# EAGLE design shoes (EAGLE 6.0)
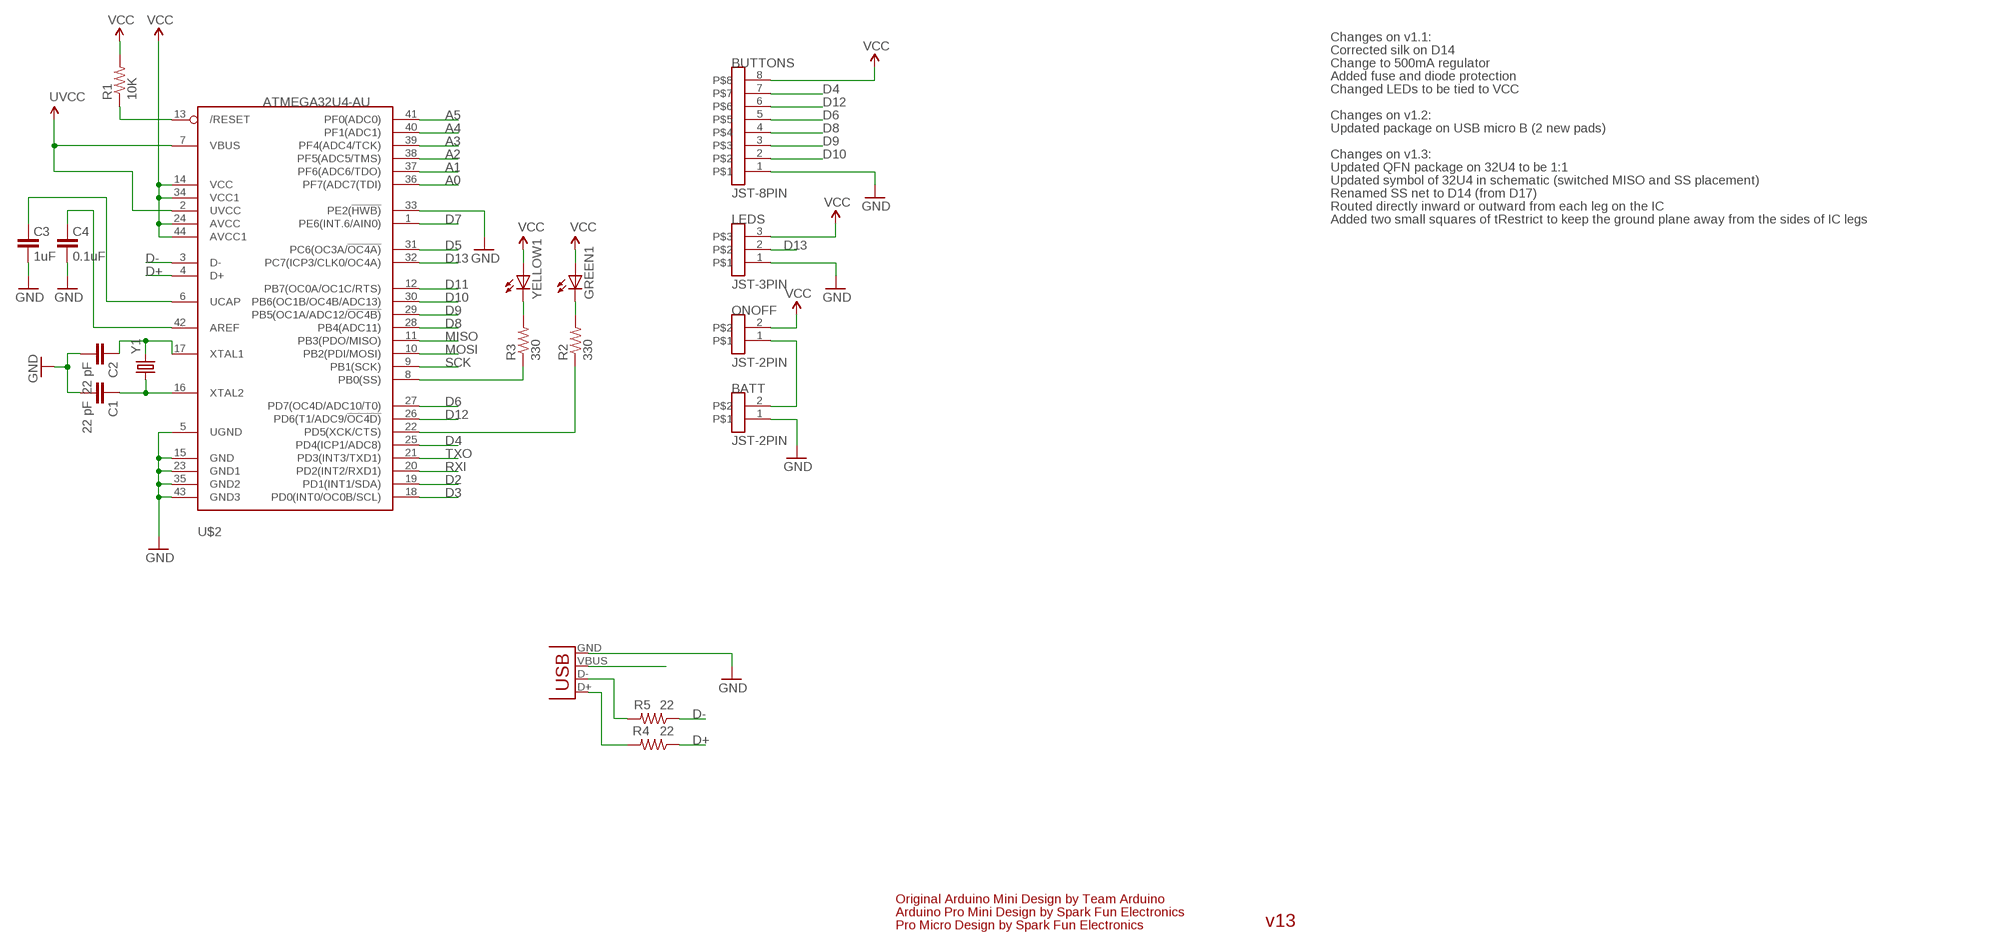
[diagram p0: schematic, sheet 1]

## Parts
BATT  JST-2PIN  [JST-PH-2]
BUTTONS  JST-8PIN  [JST-PH-8]
C1  22 pF  CAP0805  [0805]
C2  22 pF  CAP0805  [0805]
C3  1uF  CAP0805  [0805]
C4  0.1uF  CAP0805  [0805]
GREEN1  LED  [0805_P]
LEDS  JST-3PIN  [JST-PH-3]
ONOFF  JST-2PIN  [JST-PH-2]
R1  10K  RESISTOR0805-RES  [0805]
R2  330  RESISTOR0805-RES  [0805]
R3  330  RESISTOR0805-RES  [0805]
R4  22  RESISTOR0805-RES  [0805]
R5  22  RESISTOR0805-RES  [0805]
U$2  ATMEGA32U4-AU  [TQFP44]
X2  USB-MICROB  [USB-MICROB]
Y1  CRYSTALHC49US  [HC49US]
YELLOW1  LED  [0805_P]

## Nets
5V: BUTTONS.8 GREEN1.NEG(A) LEDS.3 ONOFF.2 R1.2 U$2.14(VCC) U$2.24(AVCC) U$2.34(VCC1) U$2.44(AVCC1) YELLOW1.NEG(A) ; supply symbol labelled VCC
A0: U$2.36(PF7(ADC7(TDI))
A1: U$2.37(PF6(ADC6/TDO))
A2: U$2.38(PF5(ADC5/TMS))
A3: U$2.39(PF4(ADC4/TCK))
A4: U$2.40(PF1(ADC1))
A5: U$2.41(PF0(ADC0))
D2: U$2.19(PD1(INT1/SDA))
D3: U$2.18(PD0(INT0/OC0B/SCL))
D4: BUTTONS.7 U$2.25(PD4(ICP1/ADC8))
D5: U$2.31(PC6(OC3A/!OC4A))
D6: BUTTONS.5 U$2.27(PD7(OC4D/ADC10/T0))
D7: U$2.1(PE6(INT.6/AIN0))
D8: BUTTONS.4 U$2.28(PB4(ADC11))
D9: BUTTONS.3 U$2.29(PB5(OC1A/ADC12/!OC4B))
D10: BUTTONS.2 U$2.30(PB6(OC1B/OC4B/ADC13))
D11: U$2.12(PB7(OC0A/OC1C/RTS))
D12: BUTTONS.6 U$2.26(PD6(T1/ADC9/!OC4D))
D13: LEDS.2 U$2.32(PC7(ICP3/CLK0/OC4A))
D14: R3.1 U$2.8(PB0(SS))
D+: R4.1 U$2.4(D+)
D-: R5.1 U$2.3(D-)
GND [vcc]: BATT.1 BUTTONS.1 C1.POS C2.POS C3.1 C4.1 LEDS.1 U$2.5(UGND) U$2.15(GND) U$2.23(GND1) U$2.33(PE2(!HWB)) U$2.35(GND2) U$2.43(GND3) X2.GND
MISO: U$2.11(PB3(PDO/MISO))
MOSI: U$2.10(PB2(PDI/MOSI))
N$1: C2.NEG U$2.17(XTAL1) Y1.2
N$3: R4.2 X2.D+
N$4: R5.2 X2.D-
N$9: C1.NEG U$2.16(XTAL2) Y1.1
N$11: C4.2 U$2.42(AREF)
N$12: C3.2 U$2.6(UCAP)
N$14: R3.2 YELLOW1.POS(C)
N$16: GREEN1.POS(C) R2.2
RESET1: R1.1 U$2.13(/RESET)
RXI: U$2.20(PD2(INT2/RXD1))
SCK: U$2.9(PB1(SCK))
TXLED: R2.1 U$2.22(PD5(XCK/CTS))
TXO: U$2.21(PD3(INT3/TXD1))
UVCC: U$2.2(UVCC) U$2.7(VBUS) X2.VBUS
VIN: BATT.2 ONOFF.1

## Notes on the sheet
- Changes on v1.1:
- Corrected silk on D14
- Change to 500mA regulator
- Added fuse and diode protection
- Changed LEDs to be tied to VCC
- Changes on v1.2:
- Updated package on USB micro B (2 new pads)
- Changes on v1.3:
- Updated QFN package on 32U4 to be 1:1
- Updated symbol of 32U4 in schematic (switched MISO and SS placement)
- Renamed SS net to D14 (from D17)
- Routed directly inward or outward from each leg on the IC
- Added two small squares of tRestrict to keep the ground plane away from the sides of IC legs
- Original Arduino Mini Design by Team Arduino
- Arduino Pro Mini Design by Spark Fun Electronics
- Pro Micro Design by Spark Fun Electronics | v13

## Library data of the parts
BATT ONOFF = chromatico:JST-2PIN
BUTTONS = chromatico:JST-8PIN
C1 C2 = LIT:CAP0805
C3 C4 = SparkFun:CAP: Capacitor Standard 0603 ceramic capacitor, and 0.1" leaded capacitor.
GREEN1 YELLOW1 = chromatico:LED: LEDs Standard schematic elements and footprints for 5mm, 3mm, 1206, and 0603 sized LEDs. 5mm - Spark Fun Electronics SKU : COM-00529 (and others)
LEDS = chromatico:JST-3PIN
R1-R5 = SparkFun:RESISTOR: Resistor Basic schematic elements and footprints for 0603, 1206, and PTH resistors.
U$2 = chromatico:ATMEGA32U4: http://www.ladyada.net/library/eagle
X2 = SparkFun-Connectors:USB: USB Connectors USB-B-PTH is fully proven SKU : PRT-00139 USB-miniB is fully proven SKU : PRT-00587 USB-A-PCB is untested. USB-A-H is throughly reviewed, but untested. Spark Fun Electronics SKU : PRT-00437 USB-B-SMT is throughly reviewed, but untested. Needs silkscreen touching up. USB-A-S has not been used/tested USB-MB-H has not been used/tested
Y1 = chromatico:CRYSTAL: Crystals Various standard crystals. Proven footprints. Spark Fun Electronics SKU : COM-00534

## Net classes
0 default: width 0.203 mm

## Board
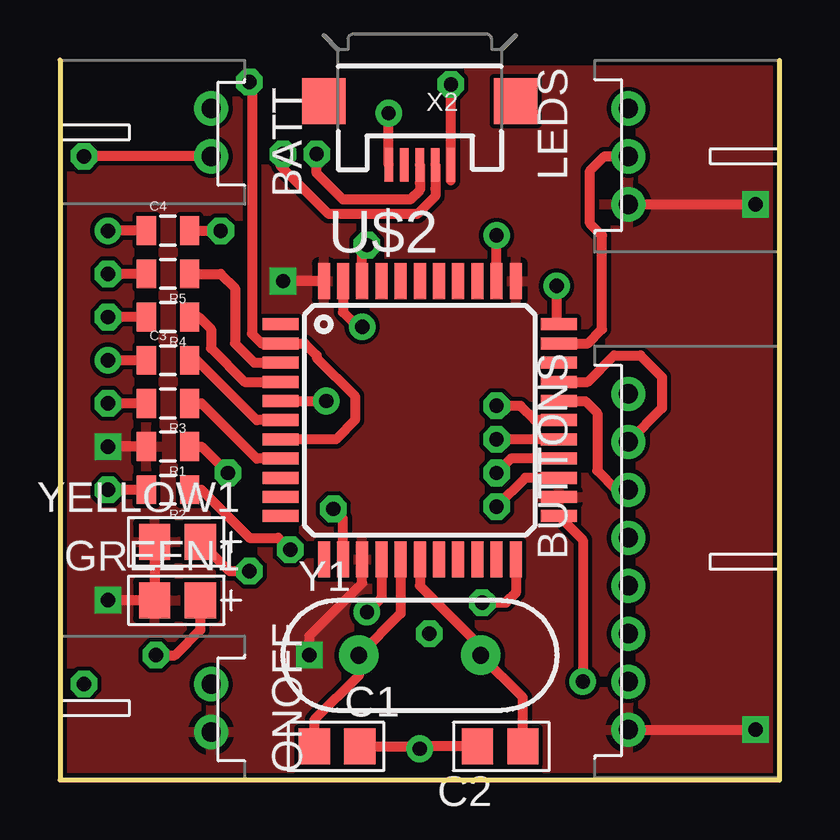
[diagram p1: board, top side]
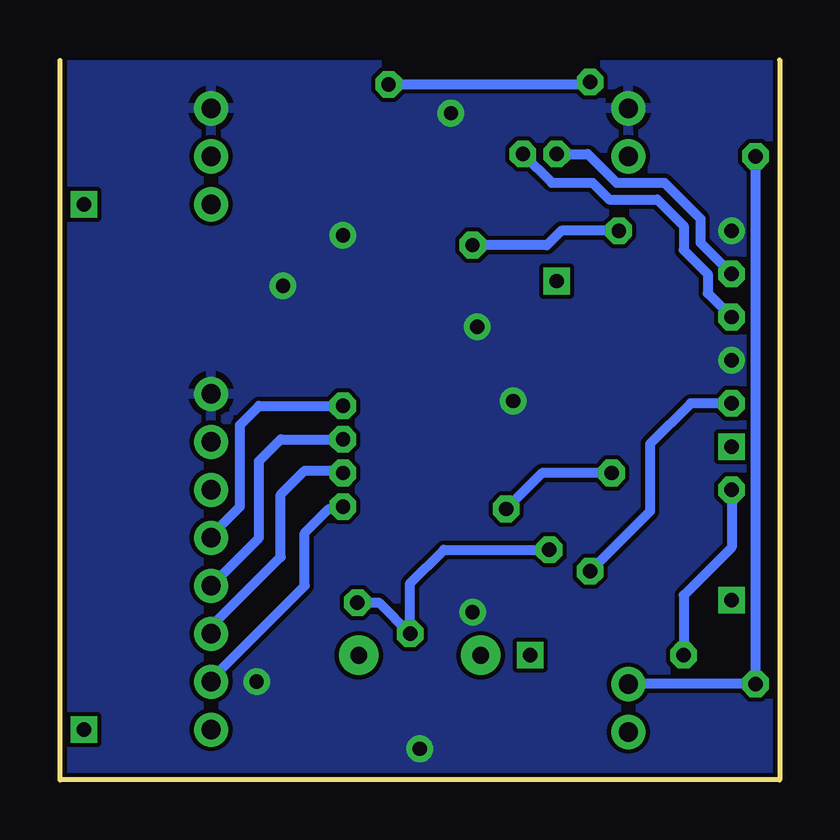
[diagram p2: board, bottom side, seen from below]

Size 30 x 30.02 mm. Coordinates in mm from the lower left corner, seen from the top.
Outline: 0,30.02 0,0 30,0 30,30
Copper layers (1*16): Top 0.035mm / dielectric 1.5mm / Bottom 0.035mm
Design rules: minimum track width 8mil, minimum drill 15mil, track to track 7mil, track to pad 7mil, pad to pad 7mil, via to via 7mil, smd to smd 7mil, copper to edge 7mil, drill to drill 7mil, minimum pad ring 12mil, minimum via ring 10mil, stop-mask expansion 4mil, vias tented up to drill 20mil, thermal gap 10mil

### Footprints (pad centres in the part's own frame; a part is rotated, then mirrored left to right if it is on the bottom)
JST-PH-2 = drill 0.8 pad 1.422: 1 2,0; 2 0,0
JST-PH-8 = drill 0.8 pad 1.422: 1 0,0; 2 2,0; 3 4,0; 4 6,0; 5 8,0; 6 10,0; 7 12,0; 8 14,0
0805 = smd 1.3 x 1.5: NEG 1.9,0; POS 0,0
0805' = smd 0.8 x 1.2: 1 -0.9,0; 2 0.9,0
0805_P = smd 1.3 x 1.5: NEG 1.9,0; POS 0,0
JST-PH-3 = drill 0.8 pad 1.422: 1 0,0; 2 2,0; 3 4,0
TQFP44 = smd 1.5 x 0.5: 1 -5.8,4; 2 -5.8,3.2; 3 -5.8,2.4; 4 -5.8,1.6; 5 -5.8,0.8; 6 -5.8,0; 7 -5.8,-0.8; 8 -5.8,-1.6; 9 -5.8,-2.4; 10 -5.8,-3.2; 11 -5.8,-4; 23 5.8,-4; 24 5.8,-3.2; 25 5.8,-2.4; 26 5.8,-1.6; 27 5.8,-0.8; 28 5.8,0; 29 5.8,0.8; 30 5.8,1.6; 31 5.8,2.4; 32 5.8,3.2; 33 5.8,4 | smd 0.5 x 1.5: 12 -4,-5.8; 13 -3.2,-5.8; 14 -2.4,-5.8; 15 -1.6,-5.8; 16 -0.8,-5.8; 17 0,-5.8; 18 0.8,-5.8; 19 1.6,-5.8; 20 2.4,-5.8; 21 3.2,-5.8; 22 4,-5.8; 34 4,5.8; 35 3.2,5.8; 36 2.4,5.8; 37 1.6,5.8; 38 0.8,5.8; 39 0,5.8; 40 -0.8,5.8; 41 -1.6,5.8; 42 -2.4,5.8; 43 -3.2,5.8; 44 -4,5.8
USB-MICROB = smd 0.35 x 1.4: D+ 0,2.65; D- -0.65,2.65; GND 1.3,2.65; ID 0.65,2.65; VBUS -1.3,2.65 | smd 1.8 x 1.9: MT1 -4,0; MT2 4,0
HC49US = drill 0.7 pad 1.651: 1 -2.54,0; 2 2.54,0

### Placement (x,y rotation side)
BATT  6.3,26 90 top
BUTTONS  23.7,16.1 270 top
C1  12.5,1.4 180 top
C2  17.4,1.4 0 top
C3  1uF  [0805']  4.5,17.5 0 top
C4  0.1uF  [0805']  4.5,22.9 0 top
GREEN1  5.85,7.49 180 top
LEDS  23.7,28 270 top
ONOFF  6.3,2 90 top
R1  10K  [0805']  4.5,13.9 180 top
R2  330  [0805']  4.5,12.1 180 top
R3  330  [0805']  4.5,15.7 180 top
R4  22  [0805']  4.5,19.3 180 top
R5  22  [0805']  4.5,21.1 180 top
U$2  15,15 0 top
X2  15,28.3 180 top
Y1  15,5.2 0 top
YELLOW1  5.85,9.93 180 top

### Tracks (layer width: path | path; a pad name or v marks a point on that pad's centre or on a via)
5V  (via drill 0.6)
  Top 0.406: LEDS.3 v29,24 | BUTTONS.8 v29,2.1 | YELLOW1.NEG GREEN1.NEG v2,7.49 v2,7.5 | U$2.44 v9.3,20.8 | R1.2 v2,13.9 | v10.4,5.2 10.4,6 12.6,8.2 U$2.14
  pour Top: 0.4,29.6 29.6,29.6 29.6,0.4 0.4,0.4
D4  (via drill 0.6)
  Top 0.406: U$2.25 19.4,12.6 v18.2,11.4
  Bottom 0.406: BUTTONS.7 23.7,4.2 19.8,8.1 19.8,10.3 18.8,11.3 18.3,11.3 v18.2,11.4
D6  (via drill 0.6)
  Top 0.406: U$2.27 v18.2,14.2
  Bottom 0.406: BUTTONS.5 21.7,10.1 21.7,13.3 U$2.27 v18.2,14.2
D8  (via drill 0.6)
  Top 0.406: U$2.28 19.8,15 19.2,15.6 v18.2,15.6
  Bottom 0.406: BUTTONS.4 23.7,10.2 22.5,11.4 22.5,14.8 21.7,15.6 v18.2,15.6
D9
  Top 0.406: U$2.29 21.9,15.8 22.4,15.3 22.4,12.9 23.2,12.1 BUTTONS.3
D10
  Top 0.406: U$2.30 22,16.6 23.1,17.7 24.2,17.7 25.1,16.8 25.1,15.5 BUTTONS.2
D12  (via drill 0.6)
  Top 0.406: U$2.26 18.8,13.4 v18.2,12.8
  Bottom 0.406: BUTTONS.6 23.7,6.4 20.8,9.3 20.8,11.9 19.8,12.9 18.3,12.9 v18.2,12.8
D13
  Top 0.406: U$2.32 22,18.2 22.6,18.8 22.6,22.7 22.1,23.2 22.1,25.4 22.7,26 LEDS.2
D14
  Top 0.406: R3.1 5.9,15.7 8.2,13.4 U$2.8
D+
  Top 0.406: R4.1 5.8,19.3 6.3,18.8 6.3,18 7.7,16.6 U$2.4
D-
  Top 0.406: R5.1 6.7,21.1 7.3,20.5 7.3,18.2 8.1,17.4 U$2.3
GND  (via drill 0.6)
  Top 0.406: C4.1 v2,22.9 | v2,17.5 C3.1 | U$2.15 13.4,7.6 v12.8,7 | U$2.35 v18.2,22.7 | v20.7,20.6 20.7,19.1 U$2.33 | C1.POS 14.9,1.4 v15,1.3 15.1,1.4 C2.POS | U$2.23 21.8,10 v21.8,4.1 | U$2.43 11.8,19.5 12.4,18.9 v12.6,18.9 | U$2.5 v11.1,15.8 | X2.GND v13.7,27.8
  pour Bottom: 0.2,29.8 29.7,29.8 29.7,0.3 0.2,0.3
N$1
  Top 0.406: C2.NEG 19.3,3.44 Y1.2 17.4,5.34 17.4,5.7 15,8.1 U$2.17
N$3  (via drill 0.6)
  Top 0.406: R4.2 v2,19.3 | 15,24.9 X2.D+ 15,24.6 14.6,24.2 11.8,24.2 10.7,25.3 v10.7,26.1
  Bottom 0.406: v10.7,26.1 9.5,24.9 7.8,24.9 7.1,24.2 5.1,24.2 4,23.1 4,22.1 3,21.1 3,20.3 v2,19.3
N$4  (via drill 0.6)
  Top 0.406: R5.2 v2,21.1 | 15.65,24.65 X2.D- 15.65,24.35 14.9,23.6 11.2,23.6 9.2,25.6 9.2,26 v9.3,26.1
  Bottom 0.406: v9.3,26.1 8,26.1 6.8,24.9 4.8,24.9 3.3,23.4 3.3,22.4 v2,21.1
N$9
  Top 0.406: U$2.16 14.2,6.94 Y1.1 12.46,4.36 10.6,2.5 C1.NEG
N$11  (via drill 0.6)
  Top 0.406: U$2.42 12.6,22.1 v12.8,22.3 | C4.2 v6.7,22.9
  Bottom 0.406: v6.7,22.9 9.1,22.9 9.7,22.3 v12.8,22.3
N$12
  Top 0.406: C3.2 5.7,17.5 8.2,15 U$2.6
N$14  (via drill 0.6)
  Top 0.406: R3.2 v2,15.7 | v7.9,8.7 7.08,8.7 YELLOW1.POS
  Bottom 0.406: v2,15.7 3.7,15.7 5.4,14 5.4,11.2 v7.9,8.7
N$16  (via drill 0.6)
  Top 0.406: R2.2 v2,12.1 | GREEN1.POS 5.85,6.25 4.8,5.2 v4,5.2
  Bottom 0.406: v2,12.1 2,9.7 4,7.7 v4,5.2
RESET1  (via drill 0.6)
  Top 0.406: R1.1 5.9,13.9 v7,12.8 | U$2.13 11.8,10.9 v11.4,11.3
  Bottom 0.406: v7,12.8 9.9,12.8 v11.4,11.3
TXLED  (via drill 0.6)
  Top 0.406: R2.1 5.9,12.1 7.9,10.1 9.1,10.1 v9.6,9.6 | U$2.22 19,7.8 18.6,7.4 v17.6,7.4
  Bottom 0.406: v9.6,9.6 14,9.6 15.4,8.2 v15.4,6.1 16.7,7.4 v17.6,7.4
UVCC  (via drill 0.6)
  Top 0.406: U$2.7 11.5,14.2 12.3,15 12.3,16 10.7,17.6 10.7,17.7 10.2,18.2 U$2.2 8.4,18.2 8,18.6 8,29 v7.9,29.1 | 16.3,25 X2.VBUS v16.3,29
  Bottom 0.406: v16.3,29 8,29 v7.9,29.1
VIN  (via drill 0.6)
  Top 0.406: BATT.2 v1,26
  Bottom 0.406: v1,26 v1,4 ONOFF.1

### Text on the board
tValues: Valid combinations: | 3.3V Reg / 8MHz | 5V Reg / 16MHz | Mark back accordingly